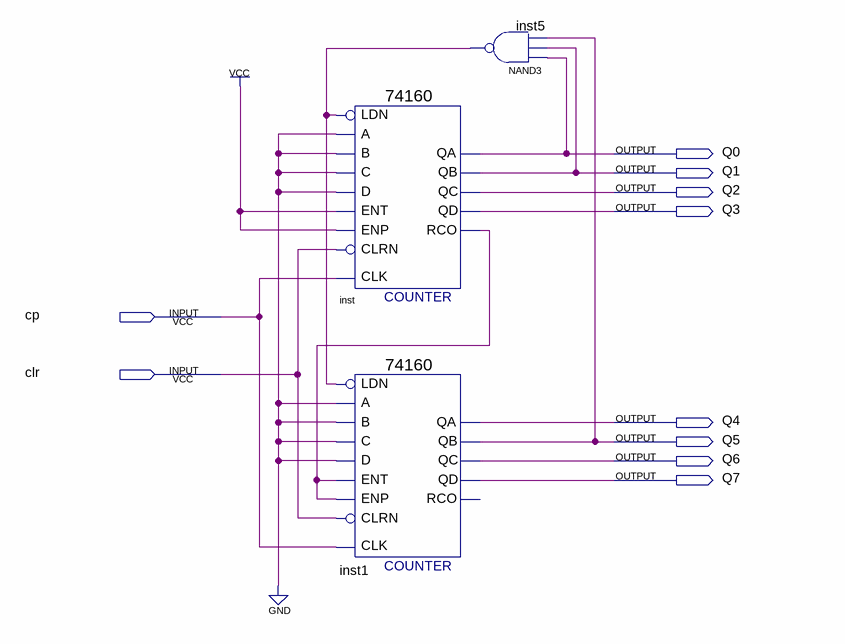
[diagram p0: schematic sheet]
// Quartus schematic CNT24.bdf as structural Verilog: 3 symbols, 10 pins
module CNT24 (
  input  cp,
  input  clr,
  output Q0,
  output Q1,
  output Q2,
  output Q3,
  output Q4,
  output Q5,
  output Q6,
  output Q7
);

  wire inst5_out, inst_rco;

  \74160  inst (
    .CLK(cp), .ENT(1'b1), .A(1'b0), .B(1'b0), .C(1'b0), .D(1'b0), .LDN(inst5_out), .ENP(1'b1), .CLRN(clr),
    .QD(Q3), .QA(Q0), .QB(Q1), .QC(Q2), .RCO(inst_rco));
  \74160  inst1 (
    .CLK(cp), .ENT(inst_rco), .A(1'b0), .B(1'b0), .C(1'b0), .D(1'b0), .LDN(inst5_out), .ENP(inst_rco),
    .CLRN(clr), .QD(Q7), .QA(Q4), .QB(Q5), .QC(Q6));  // open: RCO
  nand inst5 (inst5_out, Q0, Q1, Q5);
endmodule
